# EAGLE schematic sensors_actuators_shieldv2.0 (EAGLE 6.5.0)
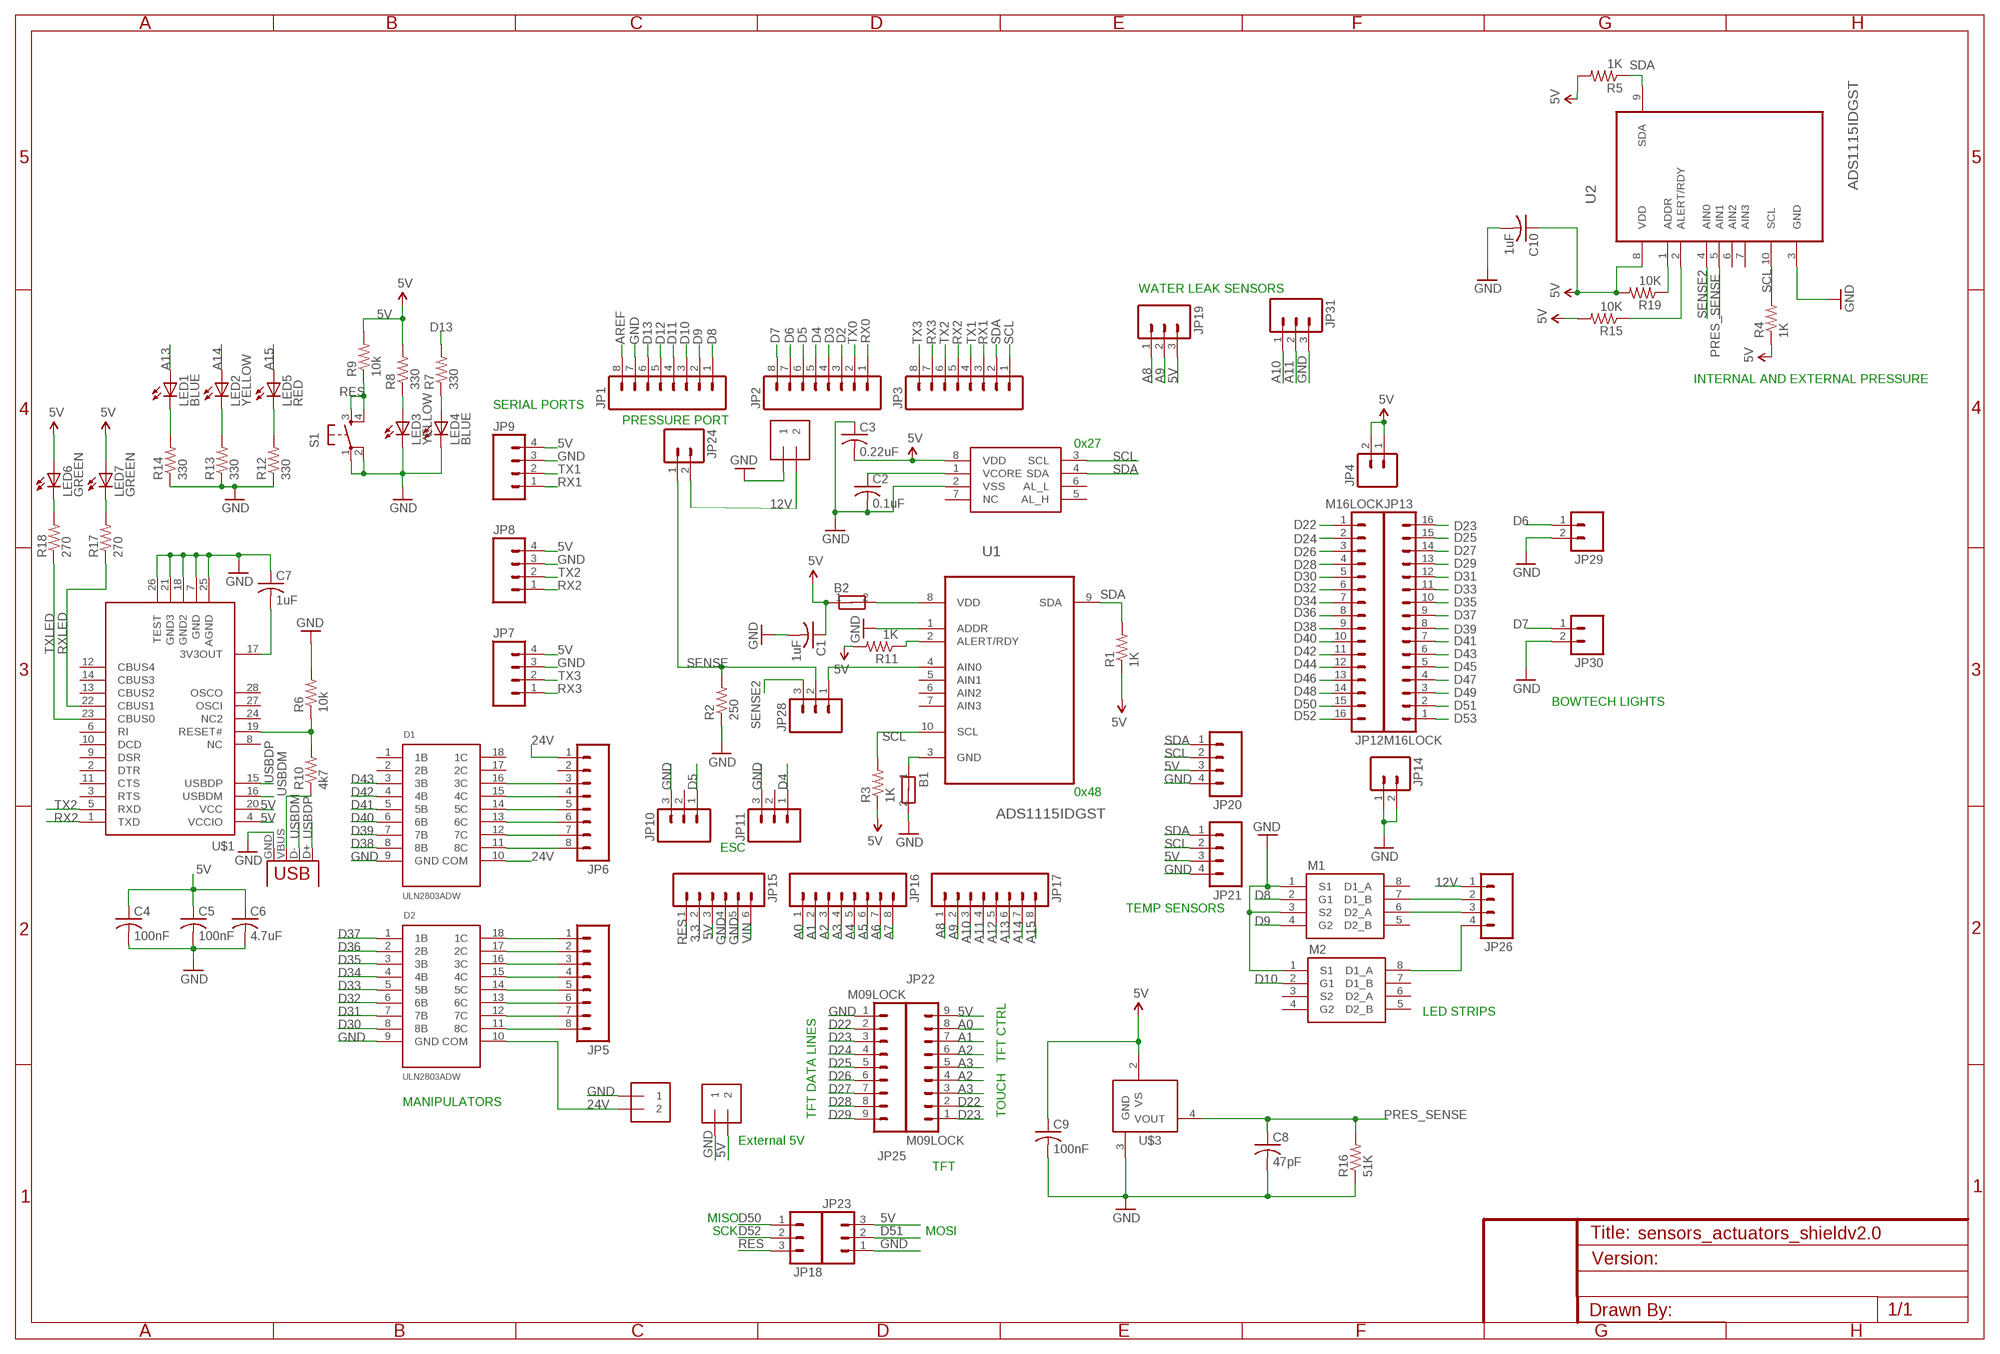
[diagram p0: schematic, sheet 1]

## Parts
B1  MMZ2012Y152B0.4OHM,500MA  [0805]
B2  MMZ2012Y152B0.4OHM,500MA  [0805]
C1  1uF  C-USC0805  [C0805]
C2  0.1uF  C-USC0805  [C0805]
C3  0.22uF  C-USC0805  [C0805]
C4  100nF  C-USC0805  [C0805]
C5  100nF  C-USC0805  [C0805]
C6  4.7uF  C-USC0805  [C0805]
C7  1uF  C-USC0805  [C0805]
C8  47pF  C-USC0805  [C0805]
C9  100nF  C-USC0805  [C0805]
C10  1uF  C-USC0805  [C0805]
D1  ULN2803ADW  [SOIC]
D2  ULN2803ADW  [SOIC]
J1  1X2-3.5MM  [1X2-3.5MM]
J2  1X2-3.5MM  [1X2-3.5MM]
J3  1X2-3.5MM  [1X2-3.5MM]
JP1  M08LOCK  [1X08_LOCK]
JP2  M08LOCK  [1X08_LOCK]
JP3  M08LOCK  [1X08_LOCK]
JP4  M02LOCK  [1X02_LOCK]
JP5  M08LOCK  [1X08_LOCK]
JP6  M08LOCK  [1X08_LOCK]
JP7  M04LOCK  [1X04_LOCK]
JP8  M04LOCK  [1X04_LOCK]
JP9  M04LOCK  [1X04_LOCK]
JP10  M03LOCK  [1X03_LOCK]
JP11  M03LOCK  [1X03_LOCK]
JP12  M16LOCK  [1X16_LOCK]
JP13  M16LOCK  [1X16_LOCK]
JP14  M02LOCK  [1X02_LOCK]
JP15  M06LOCK  [1X06_LOCK]
JP16  M08LOCK  [1X08_LOCK]
JP17  M08LOCK  [1X08_LOCK]
JP18  M03LOCK  [1X03_LOCK]
JP19  M03LOCK  [1X03_LOCK]
JP20  M04LOCK  [1X04_LOCK]
JP21  M04LOCK  [1X04_LOCK]
JP22  M09LOCK  [1X09_LOCK]
JP23  M03LOCK  [1X03_LOCK]
JP24  M02LOCK  [1X02_LOCK]
JP25  M09LOCK  [1X09_LOCK]
JP26  M04LOCK  [1X04_LOCK]
JP27  USBSMD  [USB-MINIB]
JP28  M03LOCK  [1X03_LOCK]
JP29  M02LOCK  [1X02_LOCK]
JP30  M02LOCK  [1X02_LOCK]
JP31  M03LOCK  [1X03_LOCK]
LED1  BLUE  LEDCHIPLED_0805  [CHIPLED_0805]
LED2  YELLOW  LEDCHIPLED_0805  [CHIPLED_0805]
LED3  YELLOW  LEDCHIPLED_0805  [CHIPLED_0805]
LED4  BLUE  LEDCHIPLED_0805  [CHIPLED_0805]
LED5  RED  LEDCHIPLED_0805  [CHIPLED_0805]
LED6  GREEN  LEDCHIPLED_0805  [CHIPLED_0805]
LED7  GREEN  LEDCHIPLED_0805  [CHIPLED_0805]
M1  IRF7910PBF  [SO-8]
M2  IRF7910PBF  [SO-8]
R1  1K  R-US_M0805  [M0805]
R2  250  R-US_M0805  [M0805]
R3  1K  R-US_M0805  [M0805]
R4  1K  R-US_M0805  [M0805]
R5  1K  R-US_M0805  [M0805]
R6  10k  R-US_M0805  [M0805]
R7  330  R-US_M0805  [M0805]
R8  330  R-US_M0805  [M0805]
R9  10k  R-US_M0805  [M0805]
R10  4k7  R-US_M0805  [M0805]
R11  1K  R-US_M0805  [M0805]
R12  330  R-US_M0805  [M0805]
R13  330  R-US_M0805  [M0805]
R14  330  R-US_M0805  [M0805]
R15  10K  R-US_M0805  [M0805]
R16  51K  R-US_M0805  [M0805]
R17  270  R-US_M0805  [M0805]
R18  270  R-US_M0805  [M0805]
R19  10K  R-US_M0805  [M0805]
S1  TAC_SWITCHPTH  [TACTILE-PTH]
U1  ADS1115IDGST  [SOP50P490X110-10N]
U2  ADS1115IDGST  [SOP50P490X110-10N]
U$1  FT232RL  [SSOP-28]
U$2  HIH6130  [SO-8]
U$3  MPXH6250A  [SSOP-8]

## Nets
3.3: JP15.2
5V: B2.1 C1.1 C3.2 C4.1 C5.1 C6.1 C9.1 C10.1 J3.2 JP4.1 JP4.2 JP7.4 JP8.4 JP9.4 JP15.3 JP19.3 JP20.3 JP21.3 JP22.9 JP23.3 LED6.A LED7.A R1.1 R3.1 R4.1 R5.2 R8.2 R9.2 R11.2 R15.2 R19.2 U2.8(VDD) U$1.4(VCCIO) U$1.20(VCC) U$2.8(VDD) U$3.2(VS)
12V: J1.2 JP24.2 JP26.1
24V: D1.10(COM) D2.10(COM) J2.2 JP6.1
A0: JP16.1 JP22.8
A1: JP16.2 JP22.7
A2: JP16.3 JP22.4 JP22.6
A3: JP16.4 JP22.3 JP22.5
A4: JP16.5
A5: JP16.6
A6: JP16.7
A7: JP16.8
A8: JP17.1 JP19.1
A9: JP17.2 JP19.2
A10: JP17.3 JP31.1
A11: JP17.4 JP31.2
A12: JP17.5
A13: JP17.6 LED1.A
A14: JP17.7 LED2.A
A15: JP17.8 LED5.A
AREF: JP1.8
D2: JP2.3
D3: JP2.4
D4: JP2.5 JP11.1
D5: JP2.6 JP10.1
D6: JP2.7 JP29.1
D7: JP2.8 JP30.1
D8: JP1.1 M1.2(G1)
D9: JP1.2 M1.4(G2)
D10: JP1.3 M2.2(G1)
D11: JP1.4
D12: JP1.5
D13: JP1.6 R7.2
D22: JP12.1 JP22.2 JP25.2
D23: JP13.16 JP22.1 JP25.3
D24: JP12.2 JP25.4
D25: JP13.15 JP25.5
D26: JP12.3 JP25.6
D27: JP13.14 JP25.7
D28: JP12.4 JP25.8
D29: JP13.13 JP25.9
D30: D2.8(8B) JP12.5
D31: D2.7(7B) JP13.12
D32: D2.6(6B) JP12.6
D33: D2.5(5B) JP13.11
D34: D2.4(4B) JP12.7
D35: D2.3(3B) JP13.10
D36: D2.2(2B) JP12.8
D37: D2.1(1B) JP13.9
D38: D1.8(8B) JP12.9
D39: D1.7(7B) JP13.8
D40: D1.6(6B) JP12.10
D41: D1.5(5B) JP13.7
D42: D1.4(4B) JP12.11
D43: D1.3(3B) JP13.6
D44: JP12.12
D45: JP13.5
D46: JP12.13
D47: JP13.4
D48: JP12.14
D49: JP13.3
D50: JP12.15 JP18.1
D51: JP13.2 JP23.2
D52: JP12.16 JP18.2
D53: JP13.1
GND: B1.2 C1.2 C2.2 C3.1 C4.2 C5.2 C6.2 C7.1 C8.2 C9.2 C10.2 D1.9(GND) D2.9(GND) J1.1 J2.1 J3.1 JP1.7 JP7.3 JP8.3 JP9.3 JP10.3 JP11.3 JP14.1 JP14.2 JP15.4 JP15.5 JP20.4 JP21.4 JP23.1 JP25.1 JP27.GND JP29.2 JP30.2 JP31.3 LED3.C LED4.C M1.1(S1) M1.3(S2) M2.1(S1) R2.1 R6.2 R12.1 R13.1 R14.1 R16.1 S1.1 S1.2 U1.1(ADDR) U2.3(GND) U$1.7(GND) U$1.18(GND2) U$1.21(GND3) U$1.25(AGND) U$1.26(TEST) U$2.2(VSS) U$3.3(GND)
N$1: R6.1 R10.2 U$1.19(RESET#)
N$2: LED7.C R17.2
N$3: D1.16(3C) JP6.3
N$4: D1.15(4C) JP6.4
N$5: JP28.1 U1.4(AIN0)
N$6: B1.1 U1.3(GND)
N$7: D1.14(5C) JP6.5
N$8: D1.13(6C) JP6.6
N$9: D1.12(7C) JP6.7
N$10: D1.11(8C) JP6.8
N$11: D2.18(1C) JP5.1
N$12: D2.17(2C) JP5.2
N$13: D2.14(5C) JP5.5
N$14: D2.15(4C) JP5.4
N$15: D2.11(8C) JP5.8
N$16: D2.13(6C) JP5.6
N$17: D2.12(7C) JP5.7
N$18: JP26.2 M1.7(D1_B)
N$19: D2.16(3C) JP5.3
N$20: JP26.3 M1.6(D2_A)
N$21: JP26.4 M2.8(D1_A)
N$22: R11.1 U1.2(ALERT/RDY)
N$23: C2.1 U$2.1(VCORE)
N$24: B2.2 U1.8(VDD)
N$25: LED1.C R14.2
N$26: JP27.VBUS R10.1
N$27: C7.2 U$1.17(3V3OUT)
N$28: LED2.C R13.2
N$29: LED5.C R12.2
N$30: R15.1 U2.2(ALERT/RDY)
N$31: LED6.C R18.2
N$34: R19.1 U2.1(ADDR)
N$126: LED3.A R8.1
N$127: LED4.A R7.1
PRES_SENSE: C8.1 R16.2 U2.5(AIN1) U$3.4(VOUT)
RES: JP15.1 JP18.3 R9.1 S1.3 S1.4
RX0: JP2.1
RX1: JP3.3 JP9.1
RX2: JP3.5 JP8.1 U$1.1(TXD)
RX3: JP3.7 JP7.1
RXLED: R17.1 U$1.22(CBUS1)
SCL: JP3.1 JP20.2 JP21.2 R3.2 R4.2 U1.10(SCL) U2.10(SCL) U$2.3(SCL)
SDA: JP3.2 JP20.1 JP21.1 R1.2 R5.1 U1.9(SDA) U2.9(SDA) U$2.4(SDA)
SENSE: JP24.1 JP28.2 R2.2
SENSE2: JP28.3 U2.4(AIN0)
TX0: JP2.2
TX1: JP3.4 JP9.2
TX2: JP3.6 JP8.2 U$1.5(RXD)
TX3: JP3.8 JP7.2
TXLED: R18.1 U$1.23(CBUS0)
USBDM: JP27.D- U$1.16(USBDM)
USBDP: JP27.D+ U$1.15(USBDP)
VIN: JP15.6
Unconnected: D1.1(1B) D1.2(2B) D1.17(2C) D1.18(1C) JP6.2 JP10.2 JP11.2 M1.5(D2_B) M1.8(D1_A) M2.3(S2) M2.4(G2) M2.5(D2_B) M2.6(D2_A) M2.7(D1_B) U1.5(AIN1) U1.6(AIN2) U1.7(AIN3) U2.6(AIN2) U2.7(AIN3) U$1.2(DTR) U$1.3(RTS) U$1.6(RI) U$1.8(NC) U$1.9(DSR) U$1.10(DCD) U$1.11(CTS) U$1.12(CBUS4) U$1.13(CBUS2) U$1.14(CBUS3) U$1.24(NC2) U$1.27(OSCI) U$1.28(OSCO) U$2.5(AL_H) U$2.6(AL_L) U$2.7(NC)

## Notes on the sheet
- WATER LEAK SENSORS
- INTERNAL AND EXTERNAL PRESSURE
- SERIAL PORTS
- PRESSURE PORT
- 0x27
- BOWTECH LIGHTS
- 0x48
- ESC
- TEMP SENSORS
- TFT CTRL
- LED STRIPS
- MANIPULATORS
- TFT DATA LINES | TOUCH
- External 5V
- TFT
- MISO
- SCK | MOSI

## Library data of the parts
B1 B2 = bbauv:MMZ2012Y152B; MPN: MMZ2012Y152B; OC_NEWARK: 89R3127
C1 C7 C10 = adafruit:C-US: CAPACITOR, American symbol; MF: KEMET; MPN: C0805C105M4RACTU; OC_NEWARK: 42H5473
C2 = adafruit:C-US: CAPACITOR, American symbol; MPN: 08055C104K4Z2A; OC_NEWARK: 10R5977
C3 = adafruit:C-US: CAPACITOR, American symbol; MPN: CGA4J2X8R1E224K125AA; OC_NEWARK: 52W9749
C4 C5 C9 = adafruit:C-US: CAPACITOR, American symbol; MPN: MC0805B104J500CT; OC_NEWARK: 06X6202
C6 = adafruit:C-US: CAPACITOR, American symbol; MPN: C2012X5R1A475K125AA; OC_NEWARK: 04X3272
C8 = adafruit:C-US: CAPACITOR, American symbol; MF: VISHAY/VITRAMON; MPN: VJ0805A470KXAMT; OC_NEWARK: 07J8429
D1 D2 = bbauv:ULN2803ADW: The ULN2803A is a high-voltage, high-current Darlington transistor array. The device consists of eight npn Darlington pairs that feature high-voltage outputs with common-cathode clamp diodes for switching inductive loads. The collector-current rating of each Darlington pair is 500 mA. The Darlington pairs may be connected in parallel for higher current capability. Applications include relay drivers, hammer drivers, lamp drivers, display drivers (LED and gas discharge), line drivers, and logic buffers. The ULN2803A has a 2.7-kΩ series base resistor for each Darlington pair for operation directly with TTL or 5-V CMOS devices.; MF: TEXAS INSTRUMENTS; MPN: ULN2803ADW; OC_NEWARK: 69K0711
J1-J3 = adafruit:1X2: 3.5mm Terminal block http://www.ladyada.net/library/pcb/eaglelibrary.html; MPN: 691103110002; OC_NEWARK: 16T1476
JP1-JP3 JP5 JP6 JP16 JP17 = SparkFun:M08: Header 8 Standard 8-pin 0.1" header. Use with straight break away headers (SKU : PRT-00116), right angle break away headers (PRT-00553), swiss pins (PRT-00743), machine pins (PRT-00117), and female headers (PRT-00115).; OC_NEWARK: unknown
JP4 JP14 JP24 JP29 JP30 = SparkFun:M02: Header 2 Standard 2-pin 0.1" header. Use with straight break away headers (SKU : PRT-00116), right angle break away headers (PRT-00553), swiss pins (PRT-00743), machine pins (PRT-00117), and female headers (PRT-00115). Molex polarized connector foot print use with SKU : PRT-08233 with associated crimp pins and housings.; OC_NEWARK: unknown
JP7-JP9 JP20 JP21 JP26 = SparkFun-Connectors:M04: Header 4 Standard 4-pin 0.1" header. Use with straight break away headers (SKU : PRT-00116), right angle break away headers (PRT-00553), swiss pins (PRT-00743), machine pins (PRT-00117), and female headers (PRT-00115). Molex polarized connector foot print use with SKU : PRT-08231 with associated crimp pins and housings. 1MM SMD Version SKU: PRT-10208; OC_NEWARK: unknown
JP10 JP11 JP18 JP19 JP23 JP28 JP31 = SparkFun-Connectors:M03: Header 3 Standard 3-pin 0.1" header. Use with straight break away headers (SKU : PRT-00116), right angle break away headers (PRT-00553), swiss pins (PRT-00743), machine pins (PRT-00117), and female headers (PRT-00115). Molex polarized connector foot print use with SKU : PRT-08232 with associated crimp pins and housings.; OC_NEWARK: unknown
JP12 JP13 = SparkFun:M16; OC_NEWARK: unknown
JP15 = SparkFun:M06: Header 6 Standard 6-pin 0.1" header. Use with straight break away headers (SKU : PRT-00116), right angle break away headers (PRT-00553), swiss pins (PRT-00743), machine pins (PRT-00117), and female headers (PRT-00115). Molex polarized connector foot print use with SKU : PRT-08094 with associated crimp pins and housings. NOTES ON THE VARIANTS LOCK and LOCK_LONGPADS... This footprint was designed to help hold the alignment of a through-hole component (i.e. 6-pin header) while soldering it into place. You may notice that each hole has been shifted either up or down by 0.005 of an inch from it's more standard position (which is a perfectly straight line). This slight alteration caused the pins (the squares in the middle) to touch the edges of the holes. Because they are alternating, it causes a "brace" to hold the component in place. 0.005 has proven to be the perfect amount of "off-center" position when using our standard breakaway headers. Although looks a little odd when you look at the bare footprint, once you have a header in there, the alteration is very hard to notice. Also, if you push a header all the way into place, it is covered up entirely on the bottom side. This idea of altering the position of holes to aid alignment will be further integrated into the Sparkfun Library for other footprints. It can help hold any component with 3 or more connection pins.; OC_NEWARK: unknown
JP22 JP25 = SparkFun-Connectors:M09: Header 9 Standard 9-pin 0.1" header. Use with straight break away headers (SKU : PRT-00116), right angle break away headers (PRT-00553), swiss pins (PRT-00743), machine pins (PRT-00117), and female headers (PRT-00115).; OC_NEWARK: unknown
JP27 = SparkFun-Connectors:USB: USB Connectors USB-B-PTH is fully proven SKU : PRT-00139/CONN-08278 USB-miniB is fully proven SKU : PRT-00587 USB-A-PCB is untested. USB-A-H is throughly reviewed, but untested. Spark Fun Electronics SKU : PRT-00437 USB-B-SMT is throughly reviewed, but untested. Needs silkscreen touching up. USB-A-S has not been used/tested USB-MB-H has not been used/tested USB-MICROB has been used. CONN-09505; MF: MOLEX; MPN: 67503-1020; OC_NEWARK: 64K2160
LED1 LED4 = adafruit:LED: LED OSRAM: - CHIPLED LG R971, LG N971, LY N971, LG Q971, LY Q971, LO R971, LY R971 LH N974, LH R974 LS Q976, LO Q976, LY Q976 LO Q996 - Hyper CHIPLED LW Q18S LB Q993, LB Q99A, LB R99A - SideLED LS A670, LO A670, LY A670, LG A670, LP A670 LB A673, LV A673, LT A673, LW A673 LH A674 LY A675 LS A676, LA A676, LO A676, LY A676, LW A676 LS A679, LY A679, LG A679 - Hyper Micro SIDELED® LS Y876, LA Y876, LO Y876, LY Y876 LT Y87S - SmartLED LW L88C, LW L88S LB L89C, LB L89S, LG L890 LS L89K, LO L89K, LY L89K LS L896, LA L896, LO L896, LY L896 - TOPLED LS T670, LO T670, LY T670, LG T670, LP T670 LSG T670, LSP T670, LSY T670, LOP T670, LYG T670 LG T671, LOG T671, LSG T671 LB T673, LV T673, LT T673, LW T673 LH T674 LS T676, LA T676, LO T676, LY T676, LB T676, LH T676, LSB T676, LW T676 LB T67C, LV T67C, LT T67C, LS T67K, LO T67K, LY T67K, LW E67C LS E67B, LA E67B, LO E67B, LY E67B, LB E67C, LV E67C, LT E67C LW T67C LS T679, LY T679, LG T679 LS T770, LO T770, LY T770, LG T770, LP T770 LB T773, LV T773, LT T773, LW T773 LH T774 LS E675, LA E675, LY E675, LS T675 LS T776, LA T776, LO T776, LY T776, LB T776 LHGB T686 LT T68C, LB T68C - Hyper Mini TOPLED® LB M676 - Mini TOPLED Santana® LG M470 LS M47K, LO M47K, LY M47K Source: http://www.osram.convergy.de/; MPN: 150080BS75000; OC_NEWARK: 95W3799
LED2 LED3 = adafruit:LED: LED OSRAM: - CHIPLED LG R971, LG N971, LY N971, LG Q971, LY Q971, LO R971, LY R971 LH N974, LH R974 LS Q976, LO Q976, LY Q976 LO Q996 - Hyper CHIPLED LW Q18S LB Q993, LB Q99A, LB R99A - SideLED LS A670, LO A670, LY A670, LG A670, LP A670 LB A673, LV A673, LT A673, LW A673 LH A674 LY A675 LS A676, LA A676, LO A676, LY A676, LW A676 LS A679, LY A679, LG A679 - Hyper Micro SIDELED® LS Y876, LA Y876, LO Y876, LY Y876 LT Y87S - SmartLED LW L88C, LW L88S LB L89C, LB L89S, LG L890 LS L89K, LO L89K, LY L89K LS L896, LA L896, LO L896, LY L896 - TOPLED LS T670, LO T670, LY T670, LG T670, LP T670 LSG T670, LSP T670, LSY T670, LOP T670, LYG T670 LG T671, LOG T671, LSG T671 LB T673, LV T673, LT T673, LW T673 LH T674 LS T676, LA T676, LO T676, LY T676, LB T676, LH T676, LSB T676, LW T676 LB T67C, LV T67C, LT T67C, LS T67K, LO T67K, LY T67K, LW E67C LS E67B, LA E67B, LO E67B, LY E67B, LB E67C, LV E67C, LT E67C LW T67C LS T679, LY T679, LG T679 LS T770, LO T770, LY T770, LG T770, LP T770 LB T773, LV T773, LT T773, LW T773 LH T774 LS E675, LA E675, LY E675, LS T675 LS T776, LA T776, LO T776, LY T776, LB T776 LHGB T686 LT T68C, LB T68C - Hyper Mini TOPLED® LB M676 - Mini TOPLED Santana® LG M470 LS M47K, LO M47K, LY M47K Source: http://www.osram.convergy.de/; MPN: KP-2012SYCK-J3; OC_NEWARK: 96W6948
LED5 = adafruit:LED: LED OSRAM: - CHIPLED LG R971, LG N971, LY N971, LG Q971, LY Q971, LO R971, LY R971 LH N974, LH R974 LS Q976, LO Q976, LY Q976 LO Q996 - Hyper CHIPLED LW Q18S LB Q993, LB Q99A, LB R99A - SideLED LS A670, LO A670, LY A670, LG A670, LP A670 LB A673, LV A673, LT A673, LW A673 LH A674 LY A675 LS A676, LA A676, LO A676, LY A676, LW A676 LS A679, LY A679, LG A679 - Hyper Micro SIDELED® LS Y876, LA Y876, LO Y876, LY Y876 LT Y87S - SmartLED LW L88C, LW L88S LB L89C, LB L89S, LG L890 LS L89K, LO L89K, LY L89K LS L896, LA L896, LO L896, LY L896 - TOPLED LS T670, LO T670, LY T670, LG T670, LP T670 LSG T670, LSP T670, LSY T670, LOP T670, LYG T670 LG T671, LOG T671, LSG T671 LB T673, LV T673, LT T673, LW T673 LH T674 LS T676, LA T676, LO T676, LY T676, LB T676, LH T676, LSB T676, LW T676 LB T67C, LV T67C, LT T67C, LS T67K, LO T67K, LY T67K, LW E67C LS E67B, LA E67B, LO E67B, LY E67B, LB E67C, LV E67C, LT E67C LW T67C LS T679, LY T679, LG T679 LS T770, LO T770, LY T770, LG T770, LP T770 LB T773, LV T773, LT T773, LW T773 LH T774 LS E675, LA E675, LY E675, LS T675 LS T776, LA T776, LO T776, LY T776, LB T776 LHGB T686 LT T68C, LB T68C - Hyper Mini TOPLED® LB M676 - Mini TOPLED Santana® LG M470 LS M47K, LO M47K, LY M47K Source: http://www.osram.convergy.de/; MPN: OVS-0808; OC_NEWARK: 15R2213
LED6 LED7 = adafruit:LED: LED OSRAM: - CHIPLED LG R971, LG N971, LY N971, LG Q971, LY Q971, LO R971, LY R971 LH N974, LH R974 LS Q976, LO Q976, LY Q976 LO Q996 - Hyper CHIPLED LW Q18S LB Q993, LB Q99A, LB R99A - SideLED LS A670, LO A670, LY A670, LG A670, LP A670 LB A673, LV A673, LT A673, LW A673 LH A674 LY A675 LS A676, LA A676, LO A676, LY A676, LW A676 LS A679, LY A679, LG A679 - Hyper Micro SIDELED® LS Y876, LA Y876, LO Y876, LY Y876 LT Y87S - SmartLED LW L88C, LW L88S LB L89C, LB L89S, LG L890 LS L89K, LO L89K, LY L89K LS L896, LA L896, LO L896, LY L896 - TOPLED LS T670, LO T670, LY T670, LG T670, LP T670 LSG T670, LSP T670, LSY T670, LOP T670, LYG T670 LG T671, LOG T671, LSG T671 LB T673, LV T673, LT T673, LW T673 LH T674 LS T676, LA T676, LO T676, LY T676, LB T676, LH T676, LSB T676, LW T676 LB T67C, LV T67C, LT T67C, LS T67K, LO T67K, LY T67K, LW E67C LS E67B, LA E67B, LO E67B, LY E67B, LB E67C, LV E67C, LT E67C LW T67C LS T679, LY T679, LG T679 LS T770, LO T770, LY T770, LG T770, LP T770 LB T773, LV T773, LT T773, LW T773 LH T774 LS E675, LA E675, LY E675, LS T675 LS T776, LA T776, LO T776, LY T776, LB T776 LHGB T686 LT T68C, LB T68C - Hyper Mini TOPLED® LB M676 - Mini TOPLED Santana® LG M470 LS M47K, LO M47K, LY M47K Source: http://www.osram.convergy.de/; MF: SLI (CML/IDI); MPN: CMD17-21VGC/TR8; OC_NEWARK: 34C8661
M1 M2 = bbauv:IRF7910: POWER MOSFETS High Frequency 3.3V and 5V input Point- of-Load Synchronous Buck Converters for Netcom and Computing Applications Power Management for Netcom, Computing and Portable Applications Lead-Free; MPN: IRF7910PBF; OC_NEWARK: 97K2234
R1 R3-R5 R11 = adafruit:R-US_: RESISTOR, American symbol; MF: VISHAY/DALE; MPN: CRCW08051K00FKTA; OC_NEWARK: 05F1507
R2 = adafruit:R-US_: RESISTOR, American symbol; MPN: PLTT0805Z2500AGTS; OC_NEWARK: 06X6591
R6 R9 = adafruit:R-US_: RESISTOR, American symbol; MPN: MCHP05W4F1002T5E; OC_NEWARK: 01N6989
R7 R8 R12-R14 = adafruit:R-US_: RESISTOR, American symbol; MPN: MCHP05W4F3300T5E; OC_NEWARK: 01N7024
R10 = adafruit:R-US_: RESISTOR, American symbol; MPN: CR0805-JW-472ELF; OC_NEWARK: 06X5180
R15 R19 = adafruit:R-US_: RESISTOR, American symbol; OC_NEWARK: unknown
R16 = adafruit:R-US_: RESISTOR, American symbol; MF: OUTSOURCE ITEM; MPN: RR1220P-513-B-T5; OC_NEWARK: 28K1234
R17 R18 = adafruit:R-US_: RESISTOR, American symbol; MPN: MC0805S8F2700T5E; OC_NEWARK: 79M6064
S1 = SparkFun:TAC_SWITCH: Momentary Switch Button commonly used for reset or general input. Spark Fun Electronics SKU : COM-00097; OC_NEWARK: unknown
U1 U2 = bbauv:ADS1115IDGST: Analog-to-Digital Converter with Internal Reference; MPN: ADS1115IDGST; OC_FARNELL: 1762981; OC_NEWARK: 25R1241; PACKAGE: MSOP-10; SUPPLIER: Texas Instruments
U$1 = bbauv:FT232RL: The FT232R is a USB to serial UART interface.; OC_NEWARK: unknown
U$2 = bbauv:HIH6130: Honeywell HumidIcon™ Digital Humidity/Temperature Sensors: HIH6130/6131 and HIH6120/6121 Series Honeywell HumidIcon™ Digital Humidity/Temperature Sensors: HIH6130/6131 and 6120/6121 Series is a digital output-type relative humidity (RH) and temperature sensor combined in the same package.; MPN: HIH6131-021-001; OC_NEWARK: 55T1170
U$3 = bbauv:MPXH6250A: High Temperature Accuracy Integrated Silicon Pressure Sensor for Measuring Absolute Pressure, On-Chip Signal Conditioned, Temperature Compensated and Calibrated The Freescale MPXH6250A series sensor integrates on-chip, bipolar op amp circuitry and thin film resistor networks to provide a high output signal and temperature compensation. The small form factor and high reliability of on-chip integration make the Freescale MAP sensor a logical and economical choice for automotive system designers. The MPXH6250A series piezoresistive transducer is a state-of-the-art, monolithic, signal conditioned, silicon pressure sensor. This sensor combines advanced micromachining techniques, thin film metallization, and bipolar semiconductor processing to provide an accurate, high level analog output signal that is proportional to applied pressure.; OC_NEWARK: unknown

## Net classes
0 default: width 0.178 mm, drill 0.508 mm, clearance 0.152 mm
1 power: width 0.203 mm, drill 0.508 mm, clearance 1.27 mm